# EAGLE design RS_to_DMX (EAGLE 4.16)
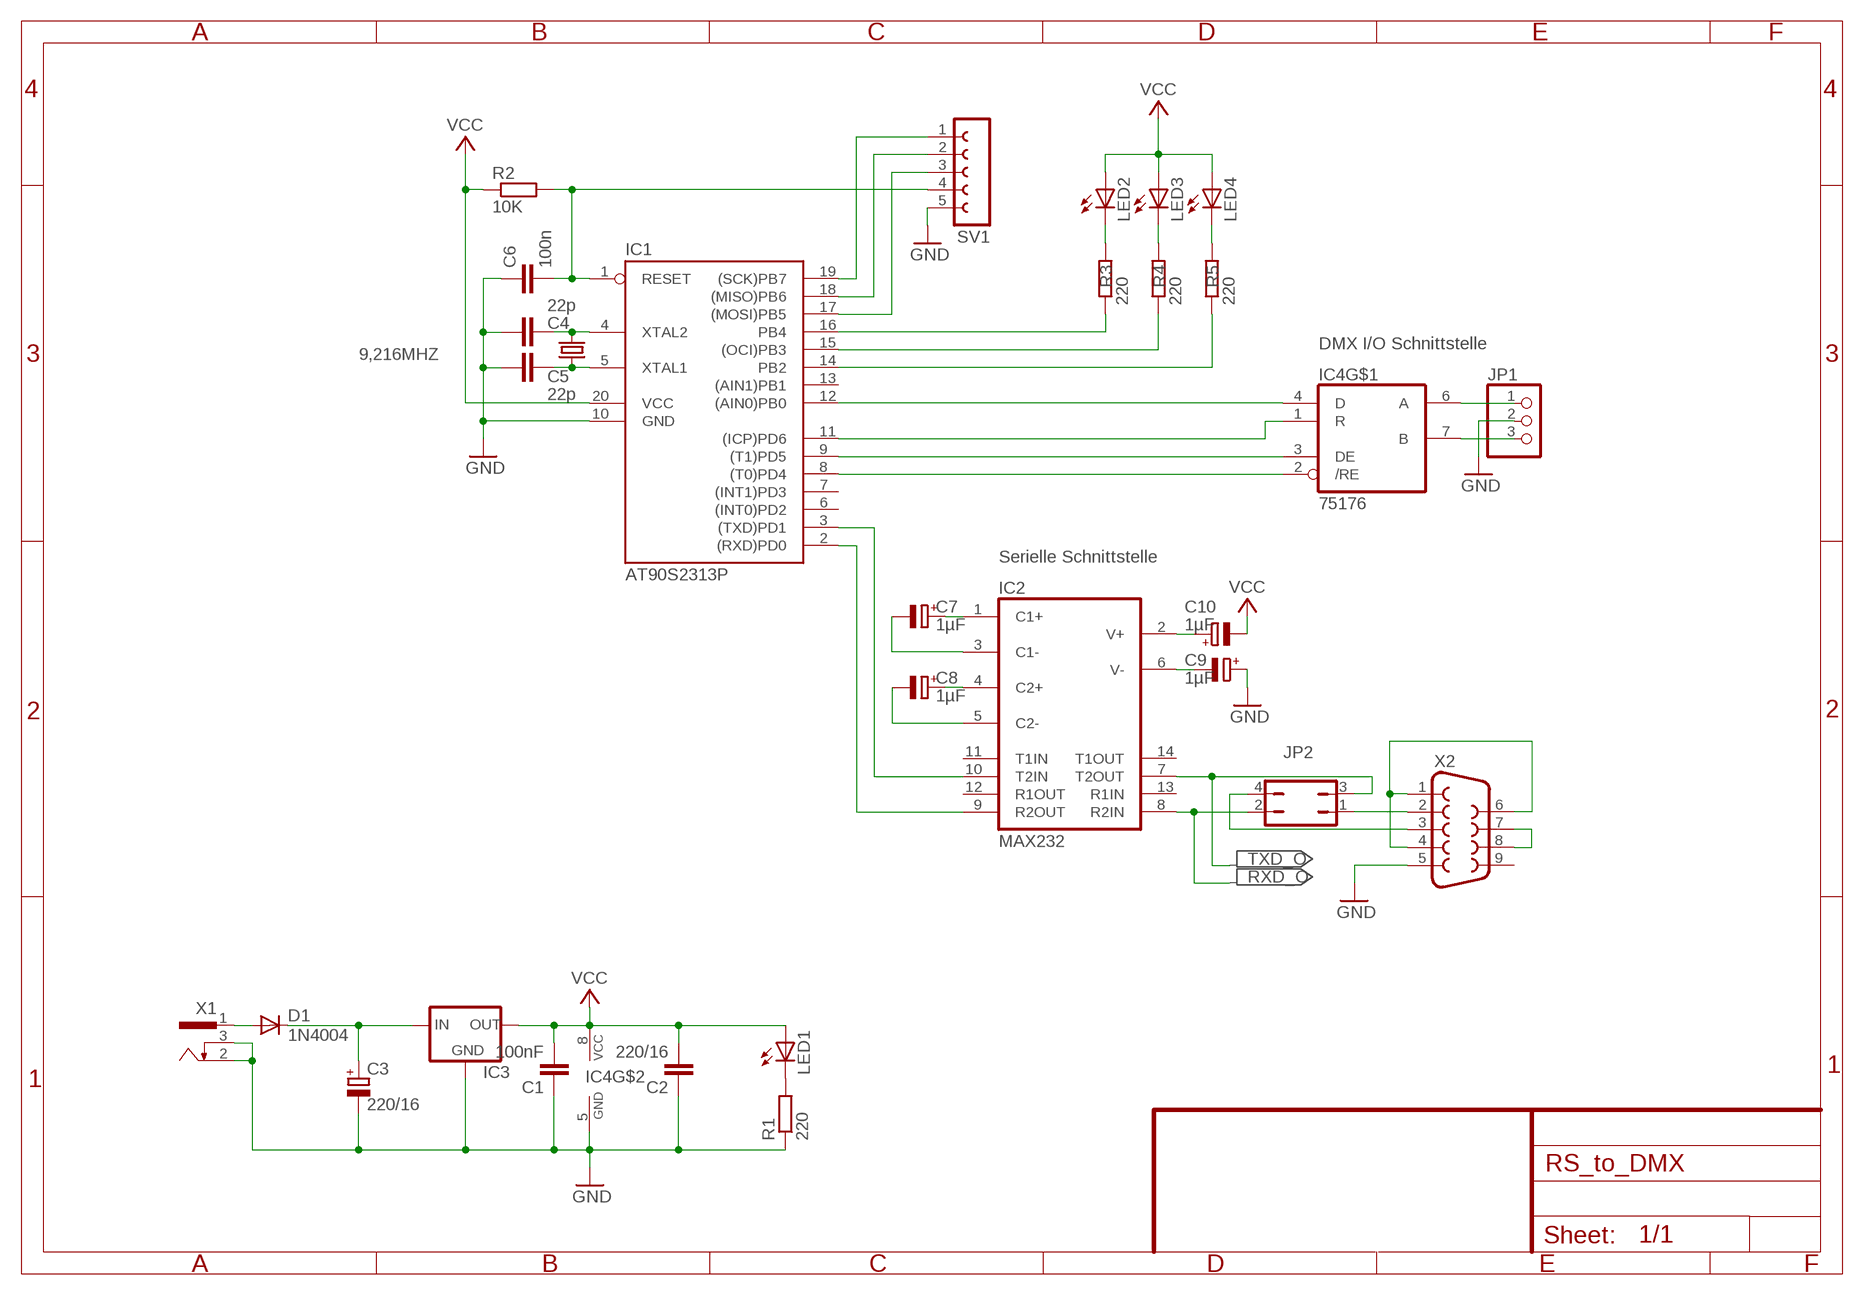
[diagram p0: schematic, sheet 1]

## Parts
9,216MHZ  CRYTALHC49S  [HC49/S]
C1  100nF  C-EU050-025X075  [C050-025X075]
C2  220/16  C-EU050-025X075  [C050-025X075]
C3  220/16  CPOL-EUE2.5-7  [E2,5-7]
C4  22p  C-EU025-024X044  [C025-024X044]
C5  22p  C-EU025-024X044  [C025-024X044]
C6  100n  C-EU050-025X075  [C050-025X075]
C7  1µF  CPOL-EUE1.8-4  [E1,8-4]
C8  1µF  CPOL-EUE1.8-4  [E1,8-4]
C9  1µF  CPOL-EUE1.8-4  [E1,8-4]
C10  1µF  CPOL-EUE1.8-4  [E1,8-4]
D1  1N4004  [DO41-10]
IC1  AT90S2313P  [DIL20]
IC2  MAX232  [DIL16]
IC3  78LXX  [78LXX]
IC4  75176  [DIL08]
JP1  PINHD-1X3  [1X03]
JP2  JP2Q  [JP2Q]
LED1  LED3MM  [LED3MM]
LED2  LED3MM  [LED3MM]
LED3  LED3MM  [LED3MM]
LED4  LED3MM  [LED3MM]
R1  220  R-EU_0207/10  [0207/10]
R2  10K  R-EU_0207/10  [0207/10]
R3  220  R-EU_0207/10  [0207/10]
R4  220  R-EU_0207/10  [0207/10]
R5  220  R-EU_0207/10  [0207/10]
SV1  FE05-1  [FE05-1]
X1  SCD-014A  [SCD-014-A]
X2  F09HP  [F09HP]

## Nets
GND: C1.1 C2.1 C3.- C4.1 C5.1 C6.1 C9.+ IC1.10(GND) IC3.GND IC4.5(GND) JP1.2 R1.1 SV1.5 X1.2 X1.3 X2.5
N$1: D1.A X1.1
N$2: C3.+ D1.C IC3.IN
N$3: IC1.19((SCK)PB7) SV1.1
N$4: IC1.18((MISO)PB6) SV1.2
N$5: LED1.K(C) R1.2
N$6: IC1.17((MOSI)PB5) SV1.3
N$7: C6.2 IC1.1(RESET) R2.2 SV1.4
N$8: 9,216MHZ.1 C5.2 IC1.5(XTAL1)
N$9: 9,216MHZ.2 C4.2 IC1.4(XTAL2)
N$10: C7.- IC2.3(C1-)
N$11: C7.+ IC2.1(C1+)
N$12: C8.+ IC2.4(C2+)
N$13: C8.- IC2.5(C2-)
N$14: C9.- IC2.6(V-)
N$15: C10.+ IC2.2(V+)
N$16: IC1.12((AIN0)PB0) IC4.4(D)
N$17: IC1.11((ICP)PD6) IC4.1(R)
N$18: JP2.1 X2.2
N$19: JP2.4 X2.3
N$20: IC1.9((T1)PD5) IC4.3(DE)
N$21: IC1.8((T0)PD4) IC4.2(/RE)
N$22: IC4.7(B) JP1.3
N$23: IC4.6(A) JP1.1
N$24: X2.7 X2.8
N$25: X2.1 X2.4 X2.6
N$26: IC1.16(PB4) R3.1
N$27: IC1.15((OCI)PB3) R4.1
N$28: IC1.14(PB2) R5.1
N$30: LED2.K(C) R3.2
N$31: LED3.K(C) R4.2
N$32: LED4.K(C) R5.2
RXD: IC1.2((RXD)PD0) IC2.9(R2OUT)
RXD_O: IC2.8(R2IN) JP2.2
TXD: IC1.3((TXD)PD1) IC2.10(T2IN)
TXD_O: IC2.7(T2OUT) JP2.3
VCC: C1.2 C2.2 C10.- IC1.20(VCC) IC3.OUT IC4.8(VCC) LED1.A LED2.A LED3.A LED4.A R2.1
Unconnected: IC1.6((INT0)PD2) IC1.7((INT1)PD3) IC1.13((AIN1)PB1) IC2.11(T1IN) IC2.12(R1OUT) IC2.13(R1IN) IC2.14(T1OUT) X2.9

## Notes on the sheet
- DMX I/O Schnittstelle
- Serielle Schnittstelle

## Power pins joined to a net without a drawn wire
GND: IC2.15(GND)
VCC: IC2.16(VCC)

## Library data of the parts
9,216MHZ = crystal:CRYTAL: CRYSTAL
C1 C2 C4-C6 = rcl:C-EU: CAPACITOR, European symbol
C3 C7-C10 = rcl:CPOL-EU: POLARIZED CAPACITOR, European symbol
D1 = diode:1N4004: DIODE general purpose rectifier, 1 A
IC1 = atmel:AT90S2313: MICROCONTROLLER 2 Kbytes FLASH 128 bytes SRAM 128 bytes EEPROM UART
IC2 = maxim:MAX232: RS232 TRANSEIVER
IC3 = v-reg:78LXX: VOLTAGE REGULATOR
IC4 = 75176:75176
JP1 = pinhead:PINHD-1X3: PIN HEADER
JP2 = jumper:JP2Q: JUMPER
LED1-LED4 = led:LED: LED OSRAM: - CHIPLED LG R971, LG N971, LY N971, LG Q971, LY Q971, LO R971, LY R971 LH N974, LH R974 LS Q976, LO Q976, LY Q976 LO Q996 - Hyper CHIPLED LW Q18S LB Q993, LB Q99A, LB R99A - SideLED LS A670, LO A670, LY A670, LG A670, LP A670 LB A673, LV A673, LT A673, LW A673 LH A674 LY A675 LS A676, LA A676, LO A676, LY A676, LW A676 LS A679, LY A679, LG A679 - Hyper Micro SIDELED® LS Y876, LA Y876, LO Y876, LY Y876 LT Y87S - SmartLED LW L88C, LW L88S LB L89C, LB L89S, LG L890 LS L89K, LO L89K, LY L89K LS L896, LA L896, LO L896, LY L896 - TOPLED LS T670, LO T670, LY T670, LG T670, LP T670 LSG T670, LSP T670, LSY T670, LOP T670, LYG T670 LG T671, LOG T671, LSG T671 LB T673, LV T673, LT T673, LW T673 LH T674 LS T676, LA T676, LO T676, LY T676, LB T676, LH T676, LSB T676, LW T676 LB T67C, LV T67C, LT T67C, LS T67K, LO T67K, LY T67K, LW E67C LS E67B, LA E67B, LO E67B, LY E67B, LB E67C, LV E67C, LT E67C LW T67C LS T679, LY T679, LG T679 LS T770, LO T770, LY T770, LG T770, LP T770 LB T773, LV T773, LT T773, LW T773 LH T774 LS E675, LA E675, LY E675, LS T675 LS T776, LA T776, LO T776, LY T776, LB T776 LHGB T686 LT T68C, LB T68C - Hyper Mini TOPLED® LB M676 - Mini TOPLED Santana® LG M470 LS M47K, LO M47K, LY M47K Source: http://www.osram.convergy.de/
R1-R5 = rcl:R-EU_: RESISTOR, European symbol
SV1 = con-lsta:FE05-1: FEMALE HEADER
X1 = con-shiua-chyuan:SCD-014A: Power Jack 2.5mm
X2 = con-subd:F09: SUB-D

## Board
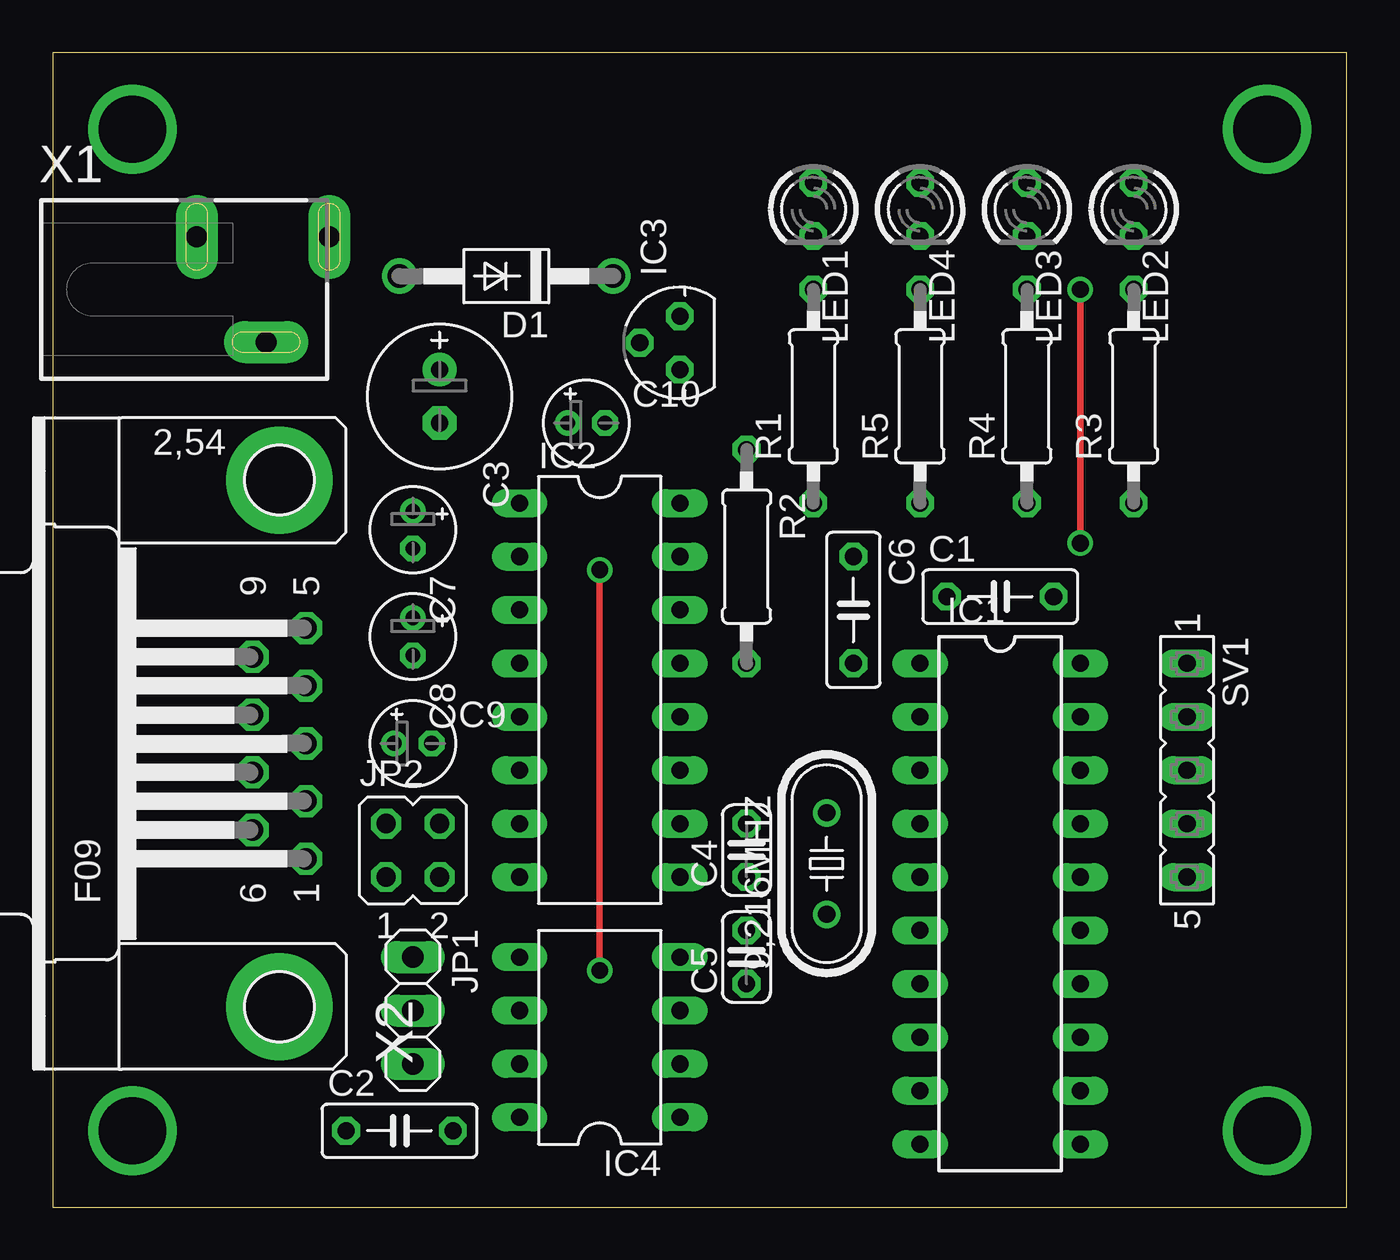
[diagram p1: board, top side]
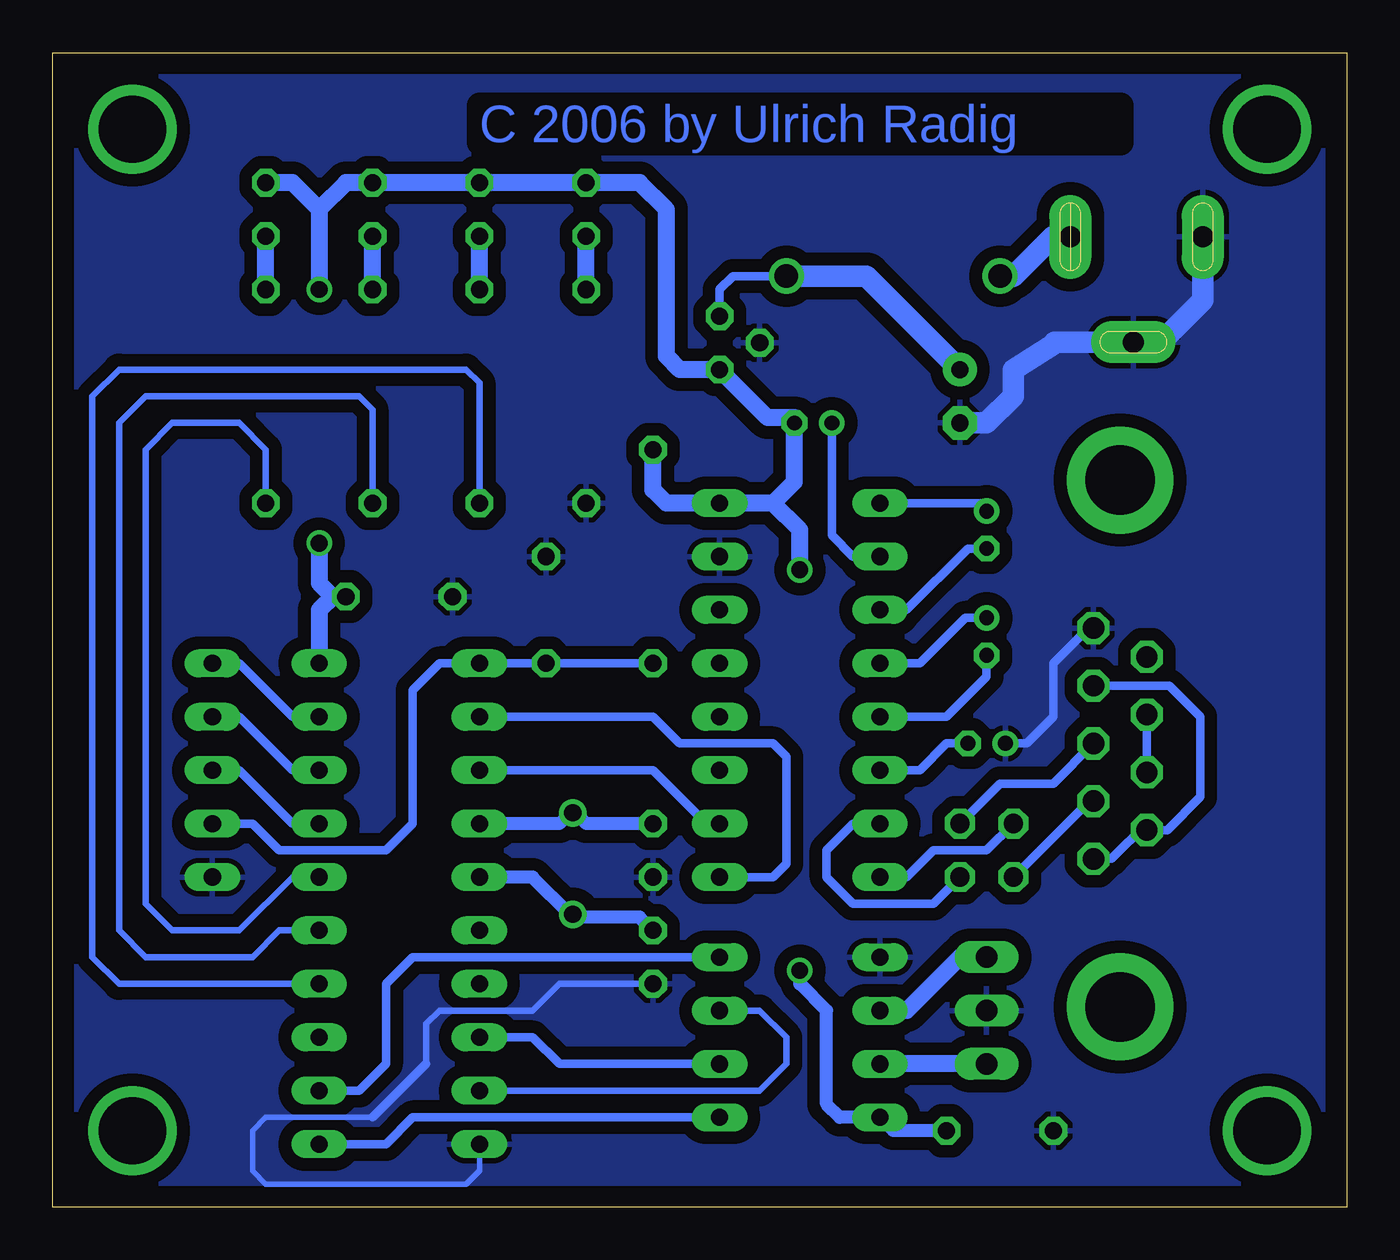
[diagram p2: board, bottom side, seen from below]

Size 61.57 x 54.91 mm. Coordinates in mm from the lower left corner, seen from the top.
Outline: 0,0 61.57,0 61.57,54.91 0,54.91 0,0
Copper layers (1*16): Top 0.035mm / dielectric 1.5mm / Bottom 0.035mm
Design rules "default": minimum track width 10mil, minimum drill 24mil, track to track 8mil, track to pad 8mil, pad to pad 8mil, via to via 8mil, smd to smd 8mil, copper to edge 40mil, drill to drill 8mil, minimum pad ring 10mil, minimum via ring 8mil, stop-mask expansion 4mil, vias tented up to drill 0mil, thermal gap 10mil

### Footprints (pad centres in the part's own frame; a part is rotated, then mirrored left to right if it is on the bottom)
HC49/S = drill 0.813 round: 1 -2.413,0; 2 2.413,0
C050-025X075 = drill 0.813 octagon: 1 -2.54,0; 2 2.54,0
E2,5-7 = drill 0.813 pad 1.6 round: + -1.27,0 | drill 0.813 pad 1.6 octagon: - 1.27,0
C025-024X044 = drill 0.813 octagon: 1 -1.27,0; 2 1.27,0
E1,8-4 = drill 0.711 pad 1.168 round: + -0.889,0 | drill 0.711 pad 1.168 octagon: - 0.889,0
DO41-10 = drill 1.118 round: A 5.08,0; C -5.08,0
DIL20 = drill 0.813 long: 1 -11.43,-3.81; 2 -8.89,-3.81; 3 -6.35,-3.81; 4 -3.81,-3.81; 5 -1.27,-3.81; 6 1.27,-3.81; 7 3.81,-3.81; 8 6.35,-3.81; 9 8.89,-3.81; 10 11.43,-3.81; 11 11.43,3.81; 12 8.89,3.81; 13 6.35,3.81; 14 3.81,3.81; 15 1.27,3.81; 16 -1.27,3.81; 17 -3.81,3.81; 18 -6.35,3.81; 19 -8.89,3.81; 20 -11.43,3.81
DIL16 = drill 0.813 long: 1 -8.89,-3.81; 2 -6.35,-3.81; 3 -3.81,-3.81; 4 -1.27,-3.81; 5 1.27,-3.81; 6 3.81,-3.81; 7 6.35,-3.81; 8 8.89,-3.81; 9 8.89,3.81; 10 6.35,3.81; 11 3.81,3.81; 12 1.27,3.81; 13 -1.27,3.81; 14 -3.81,3.81; 15 -6.35,3.81; 16 -8.89,3.81
78LXX = drill 0.813 octagon: GND 0,1.905; IN 1.27,0; OUT -1.27,0
DIL08 = drill 0.813 long: 1 -3.81,-3.81; 2 -1.27,-3.81; 3 1.27,-3.81; 4 3.81,-3.81; 5 3.81,3.81; 6 1.27,3.81; 7 -1.27,3.81; 8 -3.81,3.81
1X03 = drill 1.016 long: 1 -2.54,0; 2 0,0; 3 2.54,0
JP2Q = drill 0.914 octagon: 1 -1.27,-1.27; 2 -1.27,1.27; 3 1.27,-1.27; 4 1.27,1.27
LED3MM = drill 0.813 octagon: A -1.27,0; K 1.27,0
0207/10 = drill 0.813 octagon: 1 -5.08,0; 2 5.08,0
FE05-1 = drill 0.813 long: 1 -5.08,0; 2 -2.54,0; 3 0,0; 4 2.54,0; 5 5.08,0
SCD-014-A = drill 1 pad 2 long: 1 -2.5,13.8; 2 -2.5,7.5; 3 2.5,10.8
F09HP = drill 1.016 octagon: 1 -5.486,-1.27; 2 -2.743,-1.27; 3 0,-1.27; 4 2.743,-1.27; 5 5.486,-1.27; 6 -4.115,1.27; 7 -1.372,1.27; 8 1.372,1.27; 9 4.115,1.27 | drill 3.302 pad 5.08 round: G1 -12.522,0; G2 12.522,0

### Placement (x,y rotation side)
9,216MHZ  36.82,16.35 90 top
C1  45.08,29.05 0 top
C2  16.51,3.65 0 top
C3  18.41,38.57 270 top
C4  33.02,16.98 90 top
C5  33.02,11.9 90 top
C6  38.09,28.41 270 top
C7  17.14,32.22 270 top
C8  17.14,27.14 270 top
C9  17.14,22.06 0 top
C10  25.39,37.3 0 top
D1  21.59,44.29 180 top
IC1  45.08,14.44 270 top
IC2  26.03,24.6 270 top
IC3  29.84,41.11 90 top
IC4  26.03,8.09 90 top
JP1  17.14,9.36 270 top
JP2  17.14,16.98 0 top
LED1  36.19,47.46 270 top
LED2  51.43,47.46 270 top
LED3  46.35,47.46 270 top
LED4  41.27,47.46 270 top
R1  36.19,38.57 90 top
R2  33.02,30.95 270 top
R3  51.43,38.57 90 top
R4  46.35,38.57 90 top
R5  41.27,38.57 90 top
SV1  53.97,20.79 270 top
X1  -0.64,43.65 270 top
X2  10.79,22.06 90 top

### Tracks (layer width: path | path; a pad name or v marks a point on that pad's centre or on a via)
GND
  Bottom 0.254: 46.35,4.28 51.43,4.28 52.06,3.65 52.06,1.74 51.43,1.1 41.9,1.1 41.27,1.74 IC1.10
  Bottom 0.305: C5.1 37.46,10.63 38.73,9.36 43.17,9.36 43.81,8.73 43.81,6.82
  Bottom 0.406: C9.+ 15.23,22.06 13.96,23.33 13.96,25.87 12.06,27.78 X2.5 | 46.35,4.28 43.81,6.82
  Bottom 1.016: X1.2 6.86,43.13 8.84,41.15 X1.3 13.92,41.15 13.92,41.07 15.87,39.84 15.87,38.57 17.14,37.3 C3.-
  pour Bottom (isolate 0.61): -0.01,55.08 61.59,55.08 61.59,-0.17 -0.01,-0.17
N$1
  Bottom 1.016: X1.1 13.29,46.15 13.33,46.19 13.96,46.19 15.87,44.29 D1.A
N$2
  Bottom 0.406: D1.C 29.21,44.29 29.84,43.65 IC3.IN
  Bottom 1.016: C3.+ 22.86,44.29 D1.C
N$3
  Bottom 0.406: IC1.19 50.16,23.33 52.7,25.87 SV1.1
N$4
  Bottom 0.406: IC1.18 50.16,20.79 52.7,23.33 SV1.2
N$5
  Bottom 0.813: R1.2 LED1.K
N$6
  Bottom 0.406: IC1.17 50.16,18.25 52.7,20.79 SV1.3
N$7
  Bottom 0.406: SV1.4 52.06,18.25 50.79,16.98 45.71,16.98 44.45,18.25 44.45,24.6 43.17,25.87 IC1.1 C6.2 R2.2
N$8
  Bottom 0.61: C5.2 33.65,13.81 36.82,13.81 9,216MHZ.1 36.95,13.93 38.73,15.71 IC1.5
N$9
  Bottom 0.406: 36.82,18.89 9,216MHZ.2
  Bottom 0.61: IC1.4 37.46,18.25 36.82,18.89 36.19,18.25 C4.2
N$10
  Bottom 0.406: IC2.3 20.95,28.41 18.03,31.33 C7.-
N$11
  Bottom 0.406: C7.+ 16.76,33.11 17.14,33.49 IC2.1
N$12
  Bottom 0.406: IC2.4 20.32,25.87 18.16,28.03 C8.+
N$13
  Bottom 0.406: C8.- 17.14,25.23 19.05,23.33 IC2.5
N$14
  Bottom 0.406: IC2.6 20.32,20.79 19.05,22.06 C9.-
N$15
  Bottom 0.406: IC2.2 23.49,30.95 24.51,31.97 C10.+
N$16
  Bottom 0.406: IC4.4 44.45,11.9 45.71,10.63 45.71,6.82 46.98,5.55 IC1.12
N$17
  Bottom 0.406: IC4.1 44.45,4.28 45.71,3.01 IC1.11
N$18
  Bottom 0.406: 12.26,19.32 JP2.1
  Bottom 0.813: X2.2 12.26,19.32
N$19
  Bottom 0.406: JP2.4 16.51,20.16 13.96,20.16 X2.3
N$20
  Bottom 0.305: IC4.3 27.94,9.36 26.67,8.09 26.67,6.82 27.94,5.55 IC1.9
N$21
  Bottom 0.406: IC4.2 37.46,6.82 38.73,8.09 IC1.8
N$22
  Bottom 0.813: JP1.3 IC4.7
N$23
  Bottom 0.813: JP1.1 18.41,11.9 20.95,9.36 IC4.6
N$24
  Bottom 0.406: X2.7 X2.8
N$25
  Bottom 0.406: X2.1 11.2,16.57 9.52,18.25 | X2.6 8.55,17.95 6.98,19.52 6.98,23.33 8.45,24.8 X2.4
  Bottom 0.813: X2.6 9.52,18.25
N$26
  Bottom 0.305: IC1.16 50.16,15.71 52.7,13.17 55.88,13.17 57.14,14.44 57.14,36.03 55.88,37.3 52.7,37.3 51.43,36.03 R3.1
N$27
  Bottom 0.305: R4.1 46.35,37.94 46.98,38.57 57.14,38.57 58.41,37.3 58.41,13.17 57.14,11.9 52.06,11.9 50.79,13.17 IC1.15
N$28
  Bottom 0.305: IC1.14 58.41,10.63 59.68,11.9 59.68,38.57 58.41,39.84 41.9,39.84 41.27,39.2 R5.1
N$29  (via drill 3.2)
  other vias: 3.81,3.65
N$30
  Bottom 0.813: R3.2 LED2.K
N$31
  Bottom 0.813: R4.2 LED3.K
N$32
  Bottom 0.813: R5.2 LED4.K
N$33  (via drill 3.2)
  other vias: 3.81,51.27
N$34  (via drill 3.2)
  other vias: 57.78,51.27
N$35  (via drill 3.2)
  other vias: 57.78,3.65
RXD
  Bottom 0.406: IC1.2 33.02,23.33 31.75,22.06 27.3,22.06 26.67,21.43 26.67,16.35 27.3,15.71 IC2.9
RXD_O
  Bottom 0.406: IC2.8 20.95,15.71 19.68,16.98 17.14,16.98 JP2.2
TXD
  Bottom 0.406: IC2.10 30.48,18.25 33.02,20.79 IC1.3
TXD_O
  Bottom 0.406: JP2.3 19.68,14.44 23.49,14.44 24.76,15.71 24.76,16.98 23.49,18.25 IC2.7
VCC  (via drill 0.8)
  Top 0.305: v26.03,11.27 v26.03,30.32 | v48.89,43.65 v48.89,31.59
  Bottom 0.406: C10.- 26.28,37.55
  Bottom 0.61: C2.2 21.59,3.65 IC4.8 24.12,4.28 24.76,4.92 24.76,9.36 26.03,10.63 v26.03,11.27
  Bottom 0.813: C10.- 26.28,34.51 27.3,33.49 | 27.3,33.49 IC2.16 32.38,33.49 33.02,34.12 R2.1 | v26.03,30.32 26.03,32.22 27.3,33.49 | 26.28,37.55 27.55,37.55 IC3.OUT 31.75,39.84 32.38,40.48 32.38,47.46 33.65,48.73 LED1.A LED4.A LED3.A 47.62,48.73 48.89,47.46 | 48.25,29.05 48.89,28.41 IC1.20 | 48.25,29.05 C1.2 | 48.25,29.05 48.89,29.68 v48.89,31.59 | 48.89,47.46 v48.89,43.65 | 48.89,47.46 50.16,48.73 LED2.A

### Text on the board
Bottom: C 2006 by Ulrich Radig
bStop: C 2006 by Ulrich Radig